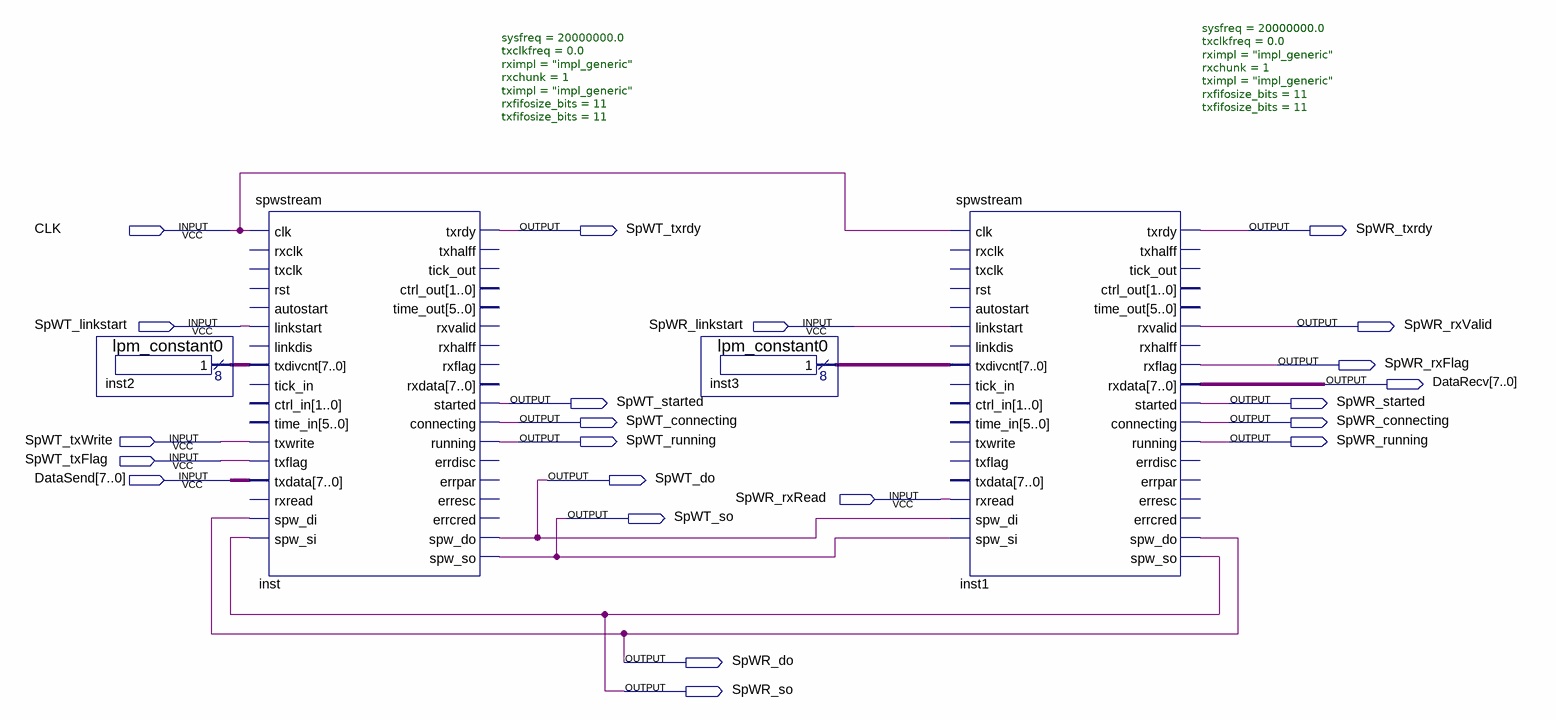
[diagram p0: schematic sheet]
// Quartus schematic spacewire.bdf as structural Verilog: 4 symbols, 22 pins
module spacewire (
  input  CLK,
  input  SpWT_linkstart,
  input  SpWR_linkstart,
  input  SpWT_txWrite,
  input  SpWT_txFlag,
  input  [7:0] DataSend,
  input  SpWR_rxRead,
  output SpWT_txrdy,
  output SpWR_txrdy,
  output SpWR_rxValid,
  output SpWR_rxFlag,
  output [7:0] DataRecv,
  output SpWT_started,
  output SpWR_started,
  output SpWT_connecting,
  output SpWR_connecting,
  output SpWT_running,
  output SpWR_running,
  output SpWT_do,
  output SpWT_so,
  output SpWR_do,
  output SpWR_so
);

  wire [7:0] inst2_result, inst3_result;

  lpm_constant0 inst2 (.result(inst2_result));
  spwstream #(.sysfreq(20000000.0), .txclkfreq(0.0), .rximpl("impl_generic"), .rxchunk(1), .tximpl("impl_generic"), .rxfifosize_bits(11), .txfifosize_bits(11)) inst (
    .clk(CLK), .linkstart(SpWT_linkstart), .txdivcnt(inst2_result), .txwrite(SpWT_txWrite),
    .txflag(SpWT_txFlag), .txdata(DataSend), .spw_di(SpWR_do), .spw_si(SpWR_so), .txrdy(SpWT_txrdy),
    .started(SpWT_started), .connecting(SpWT_connecting), .running(SpWT_running), .spw_do(SpWT_do),
    .spw_so(SpWT_so));  // open: rxclk, txclk, rst, autostart, linkdis, tick_in, ctrl_in, time_in, rxread, txhalff, tick_out, ctrl_out, time_out, rxvalid, rxhalff, rxflag, rxdata, errdisc, errpar, erresc, errcred
  lpm_constant0 inst3 (.result(inst3_result));
  spwstream #(.sysfreq(20000000.0), .txclkfreq(0.0), .rximpl("impl_generic"), .rxchunk(1), .tximpl("impl_generic"), .rxfifosize_bits(11), .txfifosize_bits(11)) inst1 (
    .clk(CLK), .linkstart(SpWR_linkstart), .txdivcnt(inst3_result), .rxread(SpWR_rxRead), .spw_di(SpWT_do),
    .spw_si(SpWT_so), .txrdy(SpWR_txrdy), .rxvalid(SpWR_rxValid), .rxflag(SpWR_rxFlag), .rxdata(DataRecv),
    .started(SpWR_started), .connecting(SpWR_connecting), .running(SpWR_running), .spw_do(SpWR_do),
    .spw_so(SpWR_so));  // open: rxclk, txclk, rst, autostart, linkdis, tick_in, ctrl_in, time_in, txwrite, txflag, txdata, txhalff, tick_out, ctrl_out, time_out, rxhalff, errdisc, errpar, erresc, errcred
endmodule
